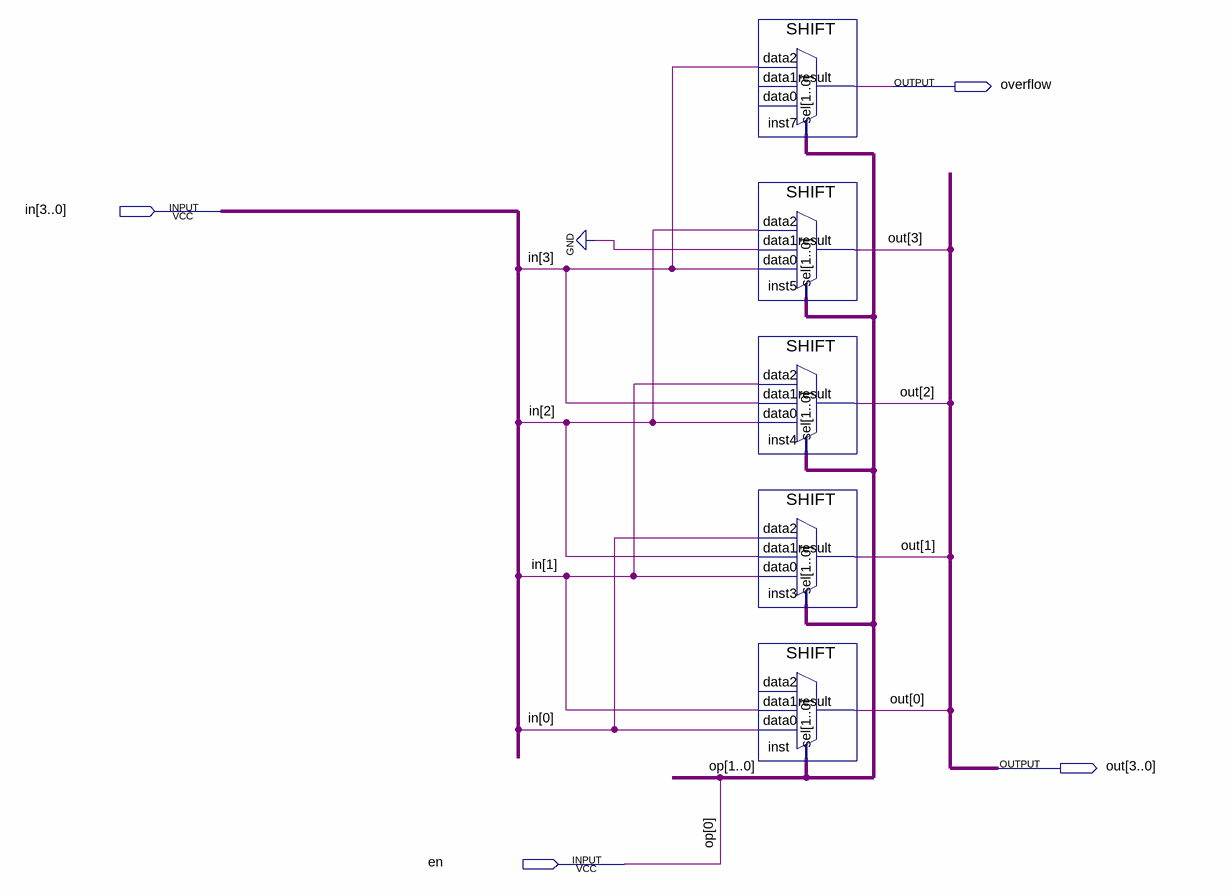
[diagram p0: schematic sheet]
// Quartus schematic Shift_Operator_Right.bdf as structural Verilog: 5 symbols, 4 pins
module Shift_Operator_Right (
  input  [3:0] in,
  input  en,
  output overflow,
  output [3:0] out
);

  wire [1:1] op;

  SHIFT inst7 (.data2(in[3]), .sel({op[1], en}), .result(overflow));  // open: data1, data0
  SHIFT inst5 (.data2(in[2]), .data1(1'b0), .data0(in[3]), .sel({op[1], en}), .result(out[3]));
  SHIFT inst4 (.data2(in[1]), .data1(in[3]), .data0(in[2]), .sel({op[1], en}), .result(out[2]));
  SHIFT inst3 (.data2(in[0]), .data1(in[2]), .data0(in[1]), .sel({op[1], en}), .result(out[1]));
  SHIFT inst (.data1(in[1]), .data0(in[0]), .sel({op[1], en}), .result(out[0]));  // open: data2

  // Other names for the same wires on the sheet: op[0] = en
endmodule
